# EAGLE design scoreboard (EAGLE 6.0)
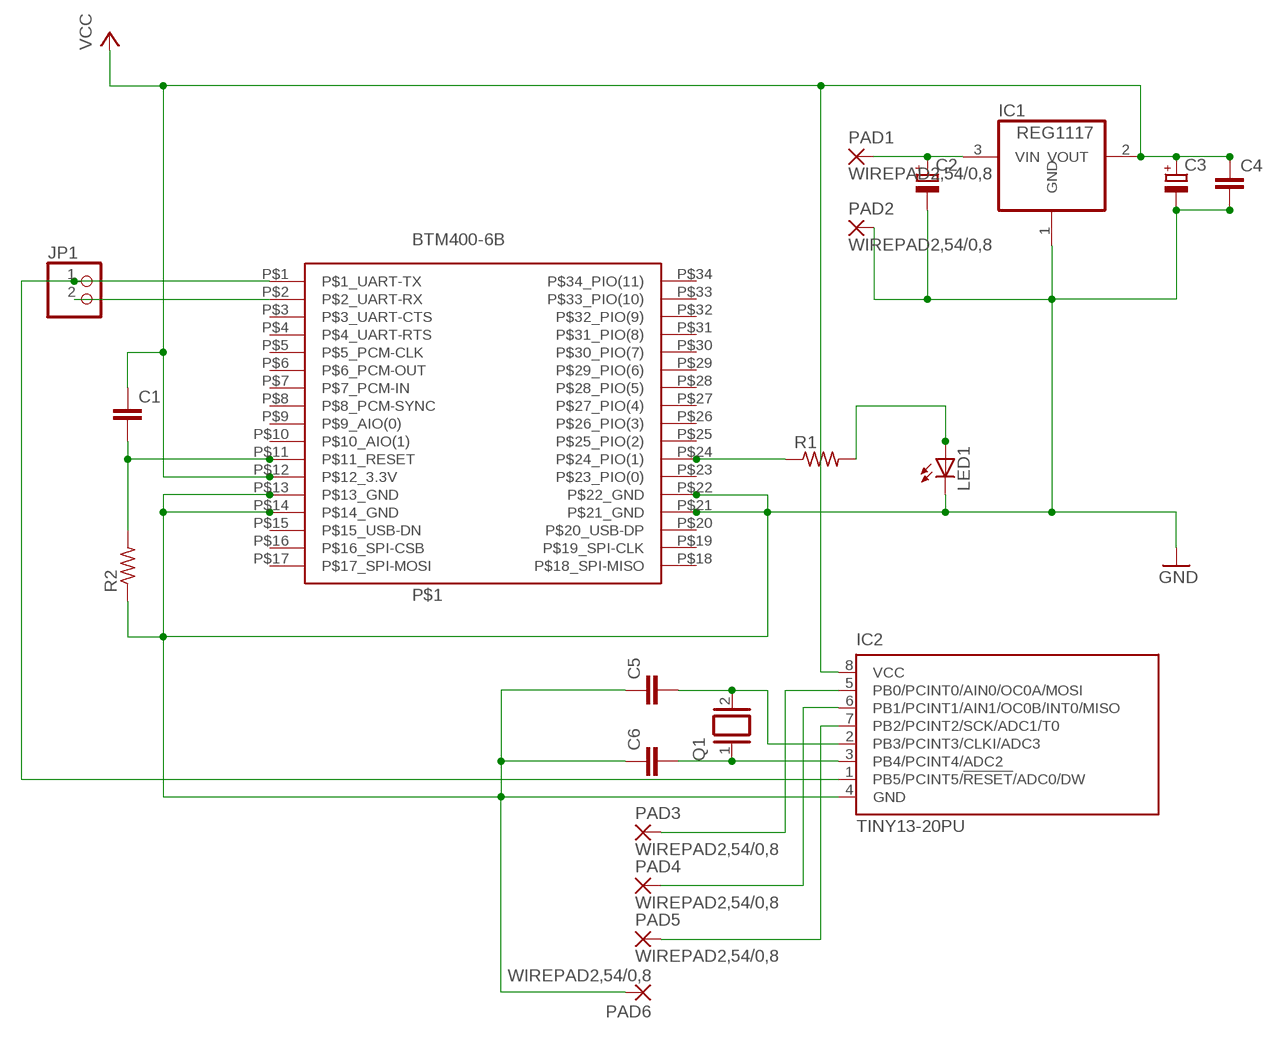
[diagram p0: schematic, sheet 1]

## Parts
C1  C-EU025-025X050  [C025-025X050]
C2  CPOL-EUE2.5-5  [E2,5-5]
C3  CPOL-EUE2.5-5  [E2,5-5]
C4  C-EU025-025X050  [C025-025X050]
C5  C-EU025-025X050  [C025-025X050]
C6  C-EU025-025X050  [C025-025X050]
IC1  REG1117  [SOT223]
IC2  TINY13-20PU  [DIL08]
JP1  PINHD-1X2  [1X02]
LED1  LED5MM  [LED5MM]
P$1  BTM400-6B  [BTM400]
PAD1  WIREPAD2,54/0,8  [2,54/0,8]
PAD2  WIREPAD2,54/0,8  [2,54/0,8]
PAD3  WIREPAD2,54/0,8  [2,54/0,8]
PAD4  WIREPAD2,54/0,8  [2,54/0,8]
PAD5  WIREPAD2,54/0,8  [2,54/0,8]
PAD6  WIREPAD2,54/0,8  [2,54/0,8]
Q1  XTAL/S  [QS]
R1  R-US_0207/10  [0207/10]
R2  R-US_0207/10  [0207/10]

## Nets
GND: C2.- C3.- C4.2 C5.1 C6.1 IC1.1(GND) IC2.4(GND) LED1.K(C) P$1.P$13(P$13_GND) P$1.P$14(P$14_GND) P$1.P$21(P$21_GND) P$1.P$22(P$22_GND) PAD2.1(P) PAD6.1(P) R2.1
N$1: IC2.1(PB5/PCINT5/!RESET!/ADC0/DW) JP1.1 P$1.P$1(P$1_UART-TX)
N$2: P$1.P$24(P$24_PIO(1)) R1.1
N$3: LED1.A R1.2
N$5: C1.2 P$1.P$11(P$11_RESET) R2.2
N$6: JP1.2 P$1.P$2(P$2_UART-RX)
N$7: C2.+ IC1.3(VIN) PAD1.1(P)
N$8: C6.2 IC2.3(PB4/PCINT4/ADC2) Q1.1
N$9: C5.2 IC2.2(PB3/PCINT3/CLKI/ADC3) Q1.2
N$10: IC2.5(PB0/PCINT0/AIN0/OC0A/MOSI) PAD3.1(P)
N$11: IC2.6(PB1/PCINT1/AIN1/OC0B/INT0/MISO) PAD4.1(P)
N$12: IC2.7(PB2/PCINT2/SCK/ADC1/T0) PAD5.1(P)
VCC: C1.1 C3.+ C4.1 IC1.2(VOUT) IC2.8(VCC) P$1.P$12(P$12_3.3V)
Unconnected: P$1.P$3(P$3_UART-CTS) P$1.P$4(P$4_UART-RTS) P$1.P$5(P$5_PCM-CLK) P$1.P$6(P$6_PCM-OUT) P$1.P$7(P$7_PCM-IN) P$1.P$8(P$8_PCM-SYNC) P$1.P$9(P$9_AIO(0)) P$1.P$10(P$10_AIO(1)) P$1.P$15(P$15_USB-DN) P$1.P$16(P$16_SPI-CSB) P$1.P$17(P$17_SPI-MOSI) P$1.P$18(P$18_SPI-MISO) P$1.P$19(P$19_SPI-CLK) P$1.P$20(P$20_USB-DP) P$1.P$23(P$23_PIO(0)) P$1.P$25(P$25_PIO(2)) P$1.P$26(P$26_PIO(3)) P$1.P$27(P$27_PIO(4)) P$1.P$28(P$28_PIO(5)) P$1.P$29(P$29_PIO(6)) P$1.P$30(P$30_PIO(7)) P$1.P$31(P$31_PIO(8)) P$1.P$32(P$32_PIO(9)) P$1.P$33(P$33_PIO(10)) P$1.P$34(P$34_PIO(11))

## Library data of the parts
C1 C4-C6 = rcl:C-EU: CAPACITOR, European symbol
C2 C3 = rcl:CPOL-EU: POLARIZED CAPACITOR, European symbol
IC1 = burr-brown:REG1117: 800mA and 1A Low Dropout (LDO) Positive Regulator 1.8V, 2.5V, 2.85V, 3.3V, 5V, and Adj; MPN: REG1117; OC_FARNELL: 1097566; OC_NEWARK: 14P6981
IC2 = atmel:TINY13: 8-bit AVR Microcontroller with 1K Bytes In-System Programmable Flash Source: http://www.atmel.com/dyn/resources/prod_documents/2535S.pdf; MPN: ATTINY13-20PU; OC_FARNELL: 9171550; OC_NEWARK: 96K6521
JP1 = pinhead:PINHD-1X2: PIN HEADER
LED1 = led:LED: LED OSRAM: - CHIPLED LG R971, LG N971, LY N971, LG Q971, LY Q971, LO R971, LY R971 LH N974, LH R974 LS Q976, LO Q976, LY Q976 LO Q996 - Hyper CHIPLED LW Q18S LB Q993, LB Q99A, LB R99A - SideLED LS A670, LO A670, LY A670, LG A670, LP A670 LB A673, LV A673, LT A673, LW A673 LH A674 LY A675 LS A676, LA A676, LO A676, LY A676, LW A676 LS A679, LY A679, LG A679 - Hyper Micro SIDELED® LS Y876, LA Y876, LO Y876, LY Y876 LT Y87S - SmartLED LW L88C, LW L88S LB L89C, LB L89S, LG L890 LS L89K, LO L89K, LY L89K LS L896, LA L896, LO L896, LY L896 - TOPLED LS T670, LO T670, LY T670, LG T670, LP T670 LSG T670, LSP T670, LSY T670, LOP T670, LYG T670 LG T671, LOG T671, LSG T671 LB T673, LV T673, LT T673, LW T673 LH T674 LS T676, LA T676, LO T676, LY T676, LB T676, LH T676, LSB T676, LW T676 LB T67C, LV T67C, LT T67C, LS T67K, LO T67K, LY T67K, LW E67C LS E67B, LA E67B, LO E67B, LY E67B, LB E67C, LV E67C, LT E67C LW T67C LS T679, LY T679, LG T679 LS T770, LO T770, LY T770, LG T770, LP T770 LB T773, LV T773, LT T773, LW T773 LH T774 LS E675, LA E675, LY E675, LS T675 LS T776, LA T776, LO T776, LY T776, LB T776 LHGB T686 LT T68C, LB T68C - Hyper Mini TOPLED® LB M676 - Mini TOPLED Santana® LG M470 LS M47K, LO M47K, LY M47K Source: http://www.osram.convergy.de LUXEON: - LUMILED® LXK2-PW12-R00, LXK2-PW12-S00, LXK2-PW14-U00, LXK2-PW14-V00 LXK2-PM12-R00, LXK2-PM12-S00, LXK2-PM14-U00 LXK2-PE12-Q00, LXK2-PE12-R00, LXK2-PE12-S00, LXK2-PE14-T00, LXK2-PE14-U00 LXK2-PB12-K00, LXK2-PB12-L00, LXK2-PB12-M00, LXK2-PB14-N00, LXK2-PB14-P00, LXK2-PB14-Q00 LXK2-PR12-L00, LXK2-PR12-M00, LXK2-PR14-Q00, LXK2-PR14-R00 LXK2-PD12-Q00, LXK2-PD12-R00, LXK2-PD12-S00 LXK2-PH12-R00, LXK2-PH12-S00 LXK2-PL12-P00, LXK2-PL12-Q00, LXK2-PL12-R00 Source: www.luxeon.com KINGBRIGHT: KA-3528ASYC Source: www.kingbright.com
P$1 = btm400-6b:BTM400-6B: BTM400 6B Bluetooth Module 13mm x 26.9mm 34 pins
PAD1-PAD6 = wirepad:WIREPAD: Wire PAD connect wire on PCB
Q1 = special:XTAL/S: CRYSTAL
R1 R2 = resistor:R-US_: RESISTOR, American symbol

## Board
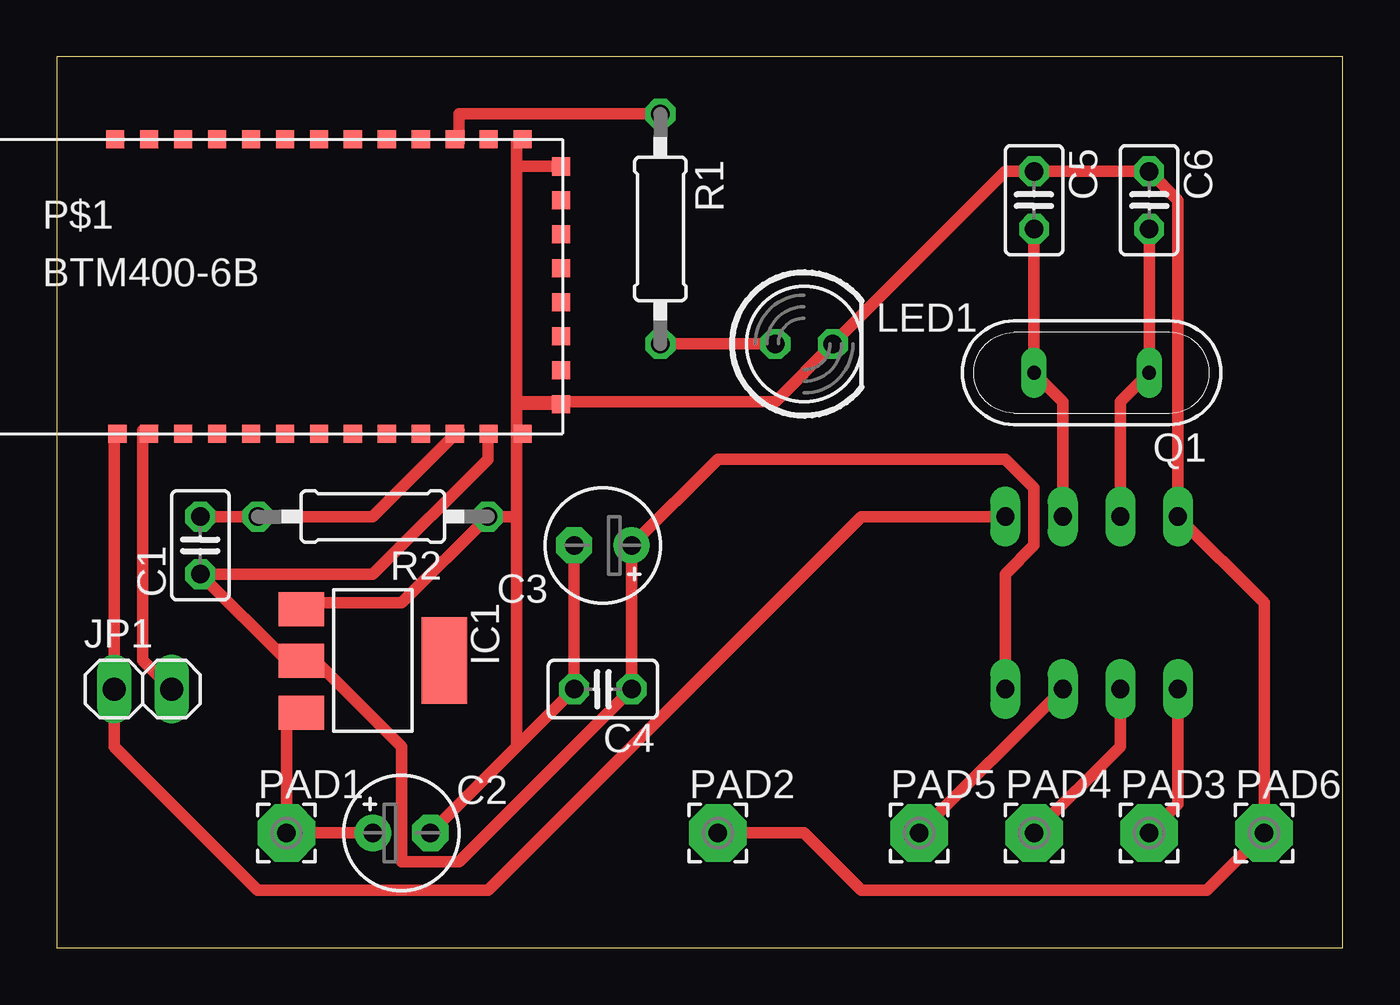
[diagram p1: board, top side]
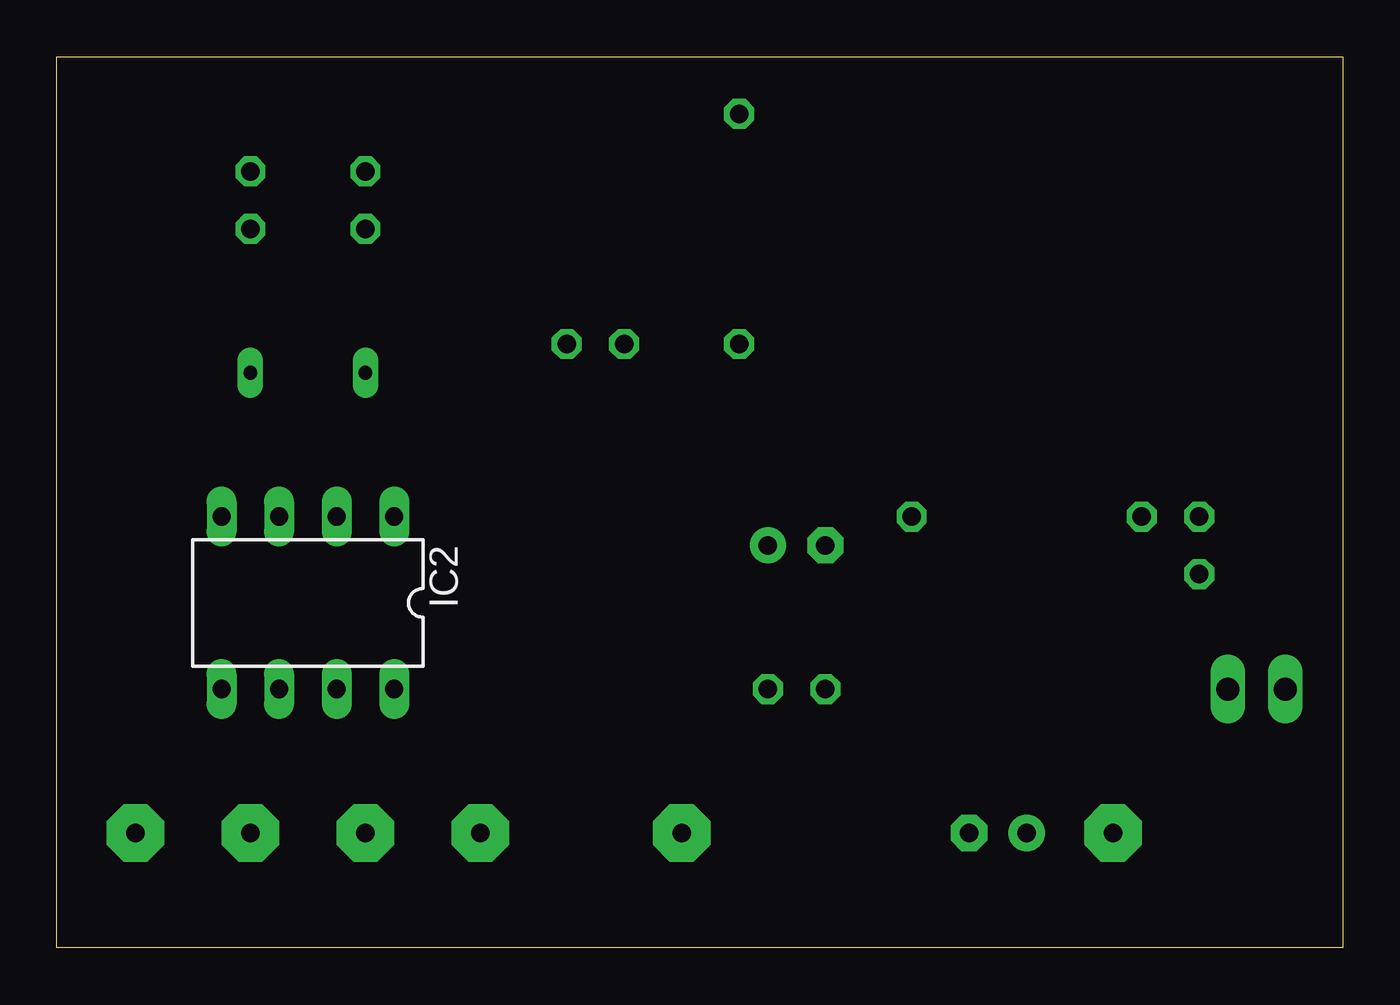
[diagram p2: board, bottom side, seen from below]

Size 56.82 x 39.36 mm. Coordinates in mm from the lower left corner, seen from the top.
Outline: 0,0 56.82,0 56.82,39.36 0,39.36 0,0
Copper layers 1: Top 0.035mm
Design rules: minimum track width 20mil, minimum drill 24mil, track to track 8mil, track to pad 8mil, pad to pad 8mil, via to via 8mil, smd to smd 8mil, copper to edge 40mil, drill to drill 8mil, minimum pad ring 10mil, minimum via ring 8mil, stop-mask expansion 4mil, vias tented up to drill 0mil, thermal gap 10mil

### Footprints (pad centres in the part's own frame; a part is rotated, then mirrored left to right if it is on the bottom)
C025-025X050 = drill 0.813 octagon: 1 -1.27,0; 2 1.27,0
E2,5-5 = drill 0.813 pad 1.6: + -1.27,0 | drill 0.813 pad 1.6 octagon: - 1.27,0
SOT223 = smd 1.499 x 2.007: 1 -2.261,-3.15; 2 0.025,-3.15; 3 2.311,-3.15 | smd 3.81 x 2.007: 4 0,3.15
DIL08 = drill 0.813 long: 1 -3.81,-3.81; 2 -1.27,-3.81; 3 1.27,-3.81; 4 3.81,-3.81; 5 3.81,3.81; 6 1.27,3.81; 7 -1.27,3.81; 8 -3.81,3.81
1X02 = drill 1.016 long: 1 -1.27,0; 2 1.27,0
LED5MM = drill 0.813 octagon: A -1.27,0; K 1.27,0
BTM400 = smd 0.8 x 0.8: P$1 -6.2,-6.5; P$2 -4.8,-6.5; P$3 -3.3,-6.5; P$4 -1.8,-6.5; P$5 -0.3,-6.5; P$6 1.2,-6.5; P$7 2.7,-6.5; P$8 4.2,-6.5; P$9 5.7,-6.5; P$10 7.2,-6.5; P$11 8.7,-6.5; P$12 10.2,-6.5; P$13 11.7,-6.5; P$14 13.4,-5.2; P$15 13.4,-3.7; P$16 13.4,-2.2; P$17 13.4,-0.7; P$18 13.4,0.8; P$19 13.4,2.3; P$20 13.4,3.8; P$21 13.4,5.3; P$22 11.7,6.5; P$23 10.2,6.5; P$24 8.7,6.5; P$25 7.2,6.5; P$26 5.7,6.5; P$27 4.2,6.5; P$28 2.7,6.5; P$29 1.2,6.5; P$30 -0.3,6.5; P$31 -1.8,6.5; P$32 -3.3,6.5; P$33 -4.8,6.5; P$34 -6.3,6.5
2,54/0,8 = drill 0.813 pad 2.54 octagon: 1 0,0
QS = drill 0.61 long: 1 -2.54,0; 2 2.54,0
0207/10 = drill 0.813 octagon: 1 -5.08,0; 2 5.08,0

### Placement (x,y rotation side)
C1  6.35,17.78 90 top
C2  15.24,5.08 0 top
C3  24.13,17.78 180 top
C4  24.13,11.43 180 top
C5  43.18,33.02 270 top
C6  48.26,33.02 270 top
IC1  13.97,12.7 270 top
IC2  45.72,15.24 180 bottom
JP1  3.81,11.43 0 top
LED1  33.02,26.67 0 top
P$1  8.89,29.21 0 top
PAD1  10.16,5.08 0 top
PAD2  29.21,5.08 0 top
PAD3  48.26,5.08 0 top
PAD4  43.18,5.08 0 top
PAD5  38.1,5.08 0 top
PAD6  53.34,5.08 0 top
Q1  45.72,25.4 180 top
R1  26.67,31.75 270 top
R2  13.97,19.05 180 top

### Tracks (layer width: path | path; a pad name or v marks a point on that pad's centre or on a via)
GND
  Top 0.508: PAD2.1 33.02,5.08 35.56,2.54 50.8,2.54 PAD6.1 53.34,15.24 IC2.4 49.53,33.02 C6.1 C5.1 41.91,34.29 LED1.K 31.75,24.13 20.32,24.13 | IC1.1 11.43,15.24 15.24,15.24 R2.1 20.32,19.05 | 20.32,34.51 20.32,35.56 P$1.P$22 | 20.32,34.51 20.32,24.13 | 20.32,24.01 20.32,22.86 | C3.- C4.2 20.32,8.89 | 20.32,8.89 C2.- | 20.32,8.89 20.32,19.05 | 20.32,19.05 20.32,22.86 | 20.32,22.86 P$1.P$13 | P$1.P$14 20.32,24.01 | 20.32,24.01 20.32,24.13 | P$1.P$21 20.32,34.51
N$1
  Top 0.508: P$1.P$1 2.54,22.86 JP1.1 2.54,8.89 8.89,2.54 19.05,2.54 35.56,19.05 IC2.1
N$2
  Top 0.508: R1.1 17.78,36.83 17.78,35.56 P$1.P$24
N$3
  Top 0.508: LED1.A R1.2
N$5
  Top 0.508: P$1.P$11 17.78,22.86 13.97,19.05 R2.2 C1.2
N$6
  Top 0.508: JP1.2 3.81,12.7 3.81,22.86 P$1.P$2
N$7
  Top 0.508: IC1.3 10.16,10.16 PAD1.1 C2.+
N$8
  Top 0.508: C6.2 Q1.1 46.99,24.13 IC2.3
N$9
  Top 0.508: C5.2 Q1.2 44.45,24.13 IC2.2
N$10
  Top 0.508: IC2.5 49.53,6.35 PAD3.1
N$11
  Top 0.508: IC2.6 46.99,8.89 PAD4.1
N$12
  Top 0.508: PAD5.1 IC2.7
VCC
  Top 0.508: P$1.P$12 19.05,22.86 19.05,21.59 13.97,16.51 C1.1 10.16,12.7 IC1.2 11.43,12.7 15.24,8.89 15.24,3.81 17.78,3.81 C4.1 C3.+ 29.21,21.59 41.91,21.59 43.18,20.32 43.18,17.78 41.91,16.51 IC2.8